# EAGLE design TOP_1P (EAGLE 9.6.2)
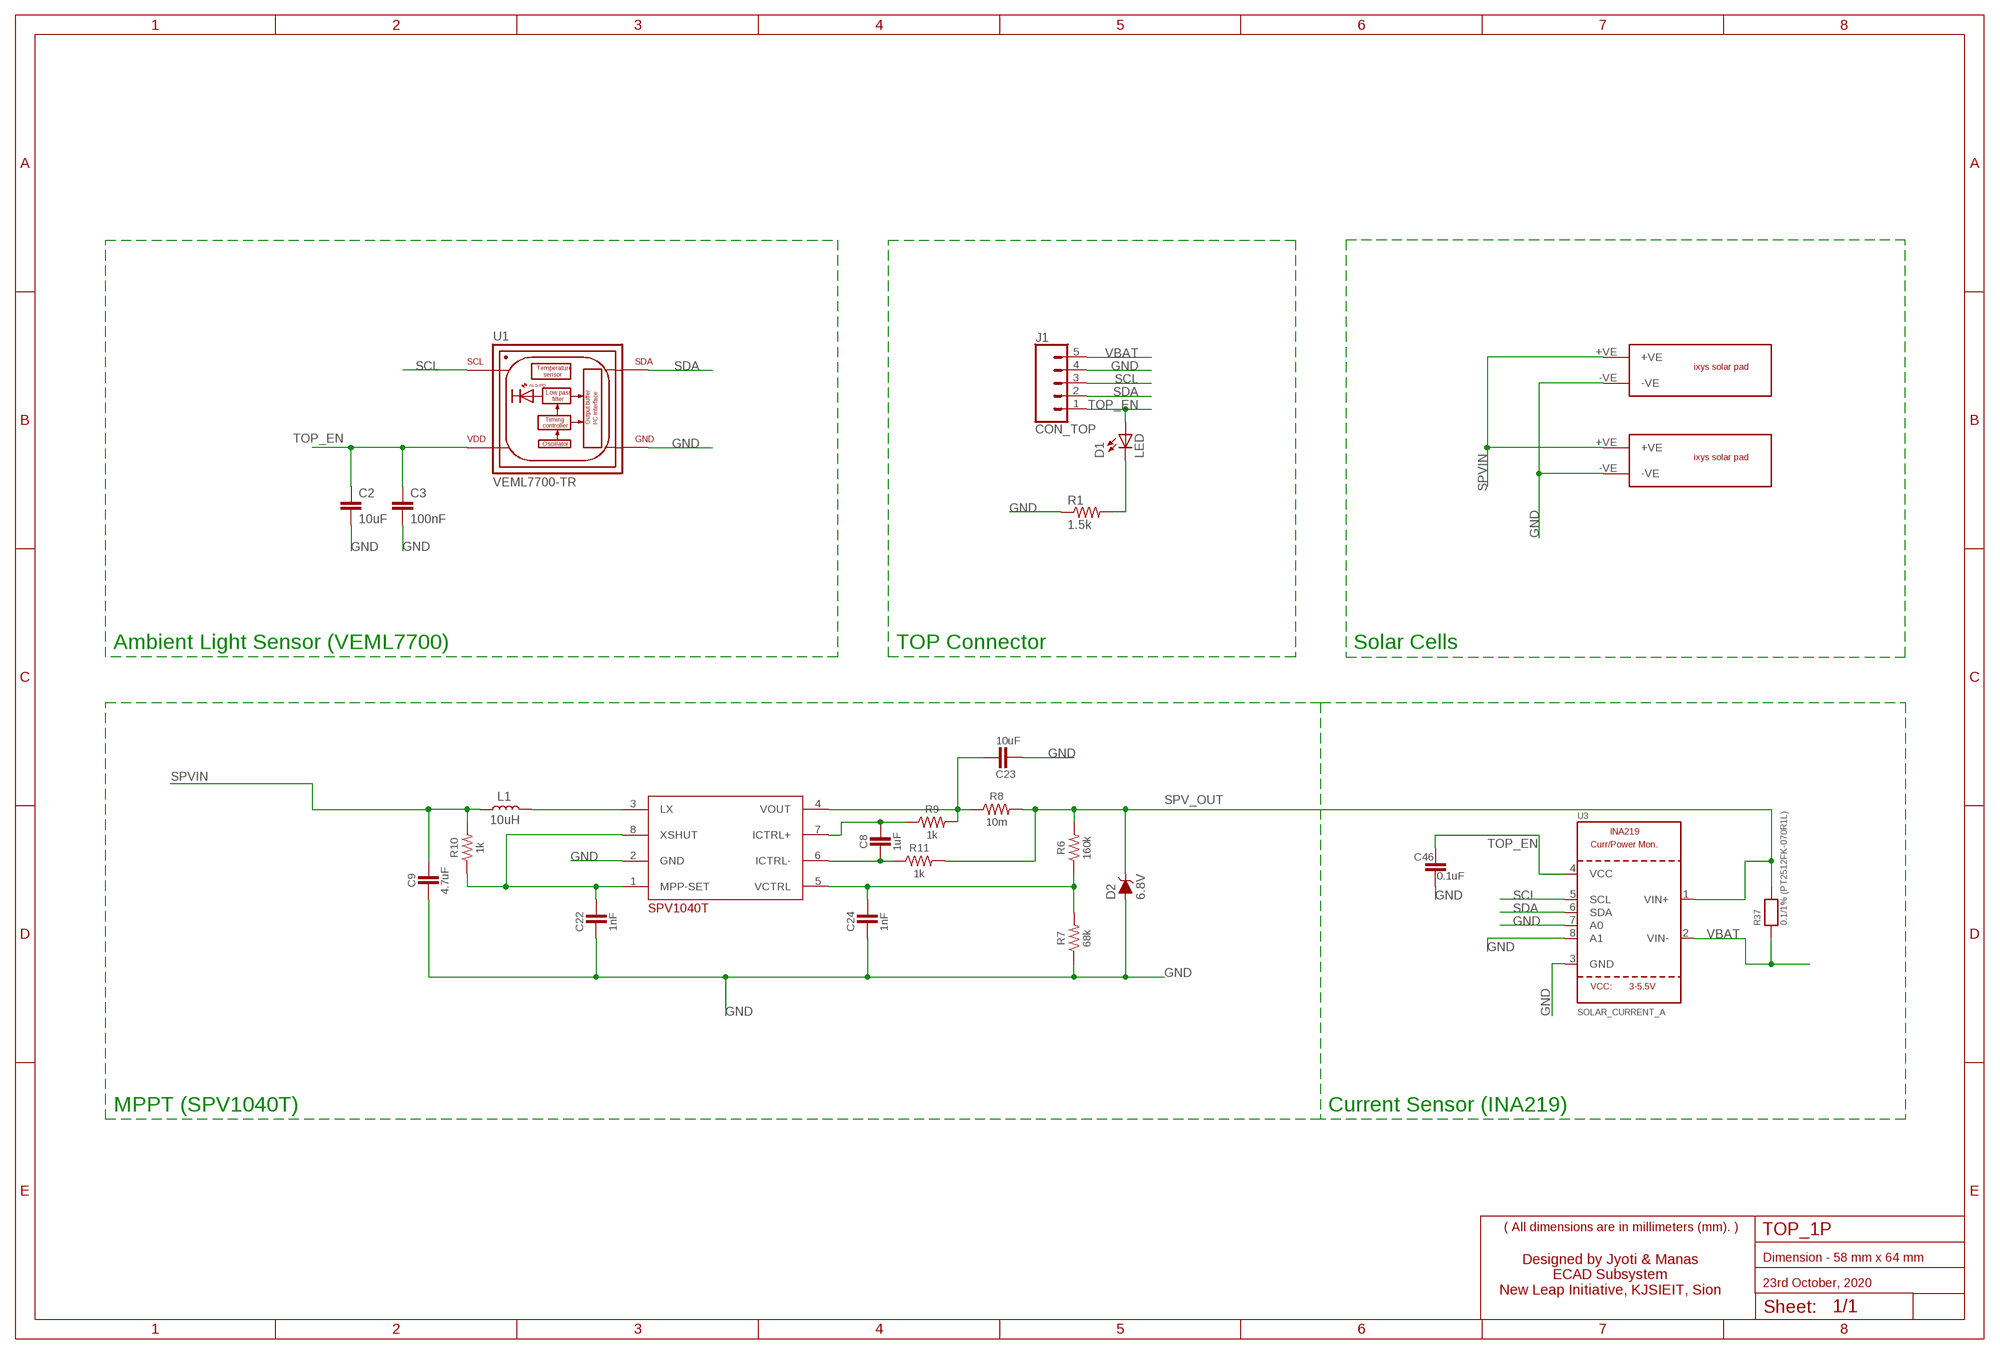
[diagram p0: schematic, sheet 1]

## Parts
C2  10uF  2.2NF/2200PF-0603-50V-10%  [0603]
C3  100nF  2.2NF/2200PF-0603-50V-10%  [0603]
C8  1uF  10UF-0603-6.3V-20%  [0603]
C9  4.7uF  10UF-0603-6.3V-20%  [0603]
C22  1nF  10UF-0603-6.3V-20%  [0603]
C23  10uF  10UF-0603-6.3V-20%  [0603]
C24  1nF  10UF-0603-6.3V-20%  [0603]
C46  0.1uF  10UF-0603-6.3V-20%  [0603]
D2  6.8V  DIODE-ZENER-MMSZ5232BS  [SOD-323]
J1  CON_TOP  CONN_051.27MM  [1X05_1.27MM]
L1  10uH  INDUCTOR-0603-33NH  [0603]
LED  D1  LEDCHIP-LED0603  [CHIP-LED0603]
R1  1.5k  R-US_R0603  [R0603]
R6  160k  RC0603JR-070RL  [RES_0603]
R7  68k  RC0603JR-070RL  [RES_0603]
R8  10m  RC0603JR-070RL  [RES_0603]
R9  1k  RC0603JR-070RL  [RES_0603]
R10  1k  RC0603JR-070RL  [RES_0603]
R11  1k  RC0603JR-070RL  [RES_0603]
R37  0.1/1% (PT2512FK-070R1L)  RESISTOR2512  [2512]
U1  VEML7700-TR  [XDCR_VEML7700-TR]
U2  U2  SPV1040T_  [SOP65P640X120-8N]
U3  SOLAR_CURRENT_A  INA219  [SOT23-8]
U$1  IXYS  [IXYS]
U$2  IXYS  [IXYS]

## Nets
GND [vcc]: C2.2 C3.2 C9.2 C22.2 C23.2 C24.2 C46.2 D2.A J1.4 R1.1 R7.1 U1.3(GND) U2.2(GND) U3.3(GND) U3.7(A0) U3.8(A1) U$1.-VE U$2.-VE
N$1: LED.C R1.2
N$5: L1.2 U2.3(LX)
N$31: C22.1 R10.1 U2.1(MPP-SET) U2.8(XSHUT)
N$32: C24.1 R6.1 R7.2 U2.5(VCTRL)
N$34: C8.2 R11.1 U2.6(ICTRL-)
N$35: C8.1 R9.1 U2.7(ICTRL+)
N$36: C23.1 R8.1 R9.2 U2.4(VOUT)
SCL: J1.3 U1.1(SCL) U3.5(SCL)
SDA: J1.2 U1.4(SDA) U3.6(SDA)
SPV_OUT: D2.C R6.2 R8.2 R11.2 R37.2 U3.1(VIN+)
SPVIN: C9.1 L1.1 R10.2 U$1.+VE U$2.+VE
TOP_EN: C2.1 C3.1 C46.1 J1.1 LED.A U1.2(VDD) U3.4(VCC)
VBAT: J1.5 R37.1 U3.2(VIN-)

## Notes on the sheet
- Ambient Light Sensor (VEML7700) | TOP Connector | Solar Cells
- MPPT (SPV1040T) | Current Sensor (INA219)
- ( All dimensions are in millimeters (mm). )
- Dimension - 58 mm x 64 mm
- Designed by Jyoti & Manas
  ECAD Subsystem
  New Leap Initiative, KJSIEIT, Sion
- 23rd October, 2020

## Library data of the parts
C2 C3 = SparkFun-Capacitors:2.2NF/2200PF: 2.2nF/2,200pF ceramic capacitors A capacitor is a passive two-terminal electrical component used to store electrical energy temporarily in an electric field.; PROD_ID: CAP-07877; VALUE: 2.2nF
C8 C9 C22 C24 C46 = SparkFun-Capacitors:10UF: 10.0µF ceramic capacitors A capacitor is a passive two-terminal electrical component used to store electrical energy temporarily in an electric field.; PROD_ID: CAP-11015; VALUE: 10uF
C23 = SparkFun-Capacitors:10UF: 10.0µF ceramic capacitors A capacitor is a passive two-terminal electrical component used to store electrical energy temporarily in an electric field.; PROD_ID: CAP-11015
D2 = SparkFun-DiscreteSemi:DIODE-ZENER: Zener Diode A Zener diode allows current to flow from its anode to its cathode like a normal semiconductor diode, but it also permits current to flow in the reverse direction when its "Zener voltage" is reached. - WIkipedia; PROD_ID: DIO-12442; VALUE: 5.6V
J1 = SparkFun-Connectors:CONN_05: Multi connection point. Often used as Generic Header-pin footprint for 0.1 inch spaced/style header connections On any of the 0.1 inch spaced packages, you can populate with these: Break Away Headers - Straight <https://www.sparkfun.com/products/116> (PRT-00116) Break Away Male Headers - Right Angle <https://www.sparkfun.com/products/553> (PRT-00553) Female Headers <https://www.sparkfun.com/products/115> (PRT-00115) Break Away Headers - Machine Pin <https://www.sparkfun.com/products/117> (PRT-00117) Break Away Female Headers - Swiss Machine Pin <https://www.sparkfun.com/products/743> (PRT-00743) For SCREWTERMINALS and SPRING TERMINALS visit here: Screw Terimnals on SparkFun.com <https://www.sparkfun.com/search/results?term=Screw+Terminals> (5mm/3.5mm/2.54mm spacing) This device is also useful as a general connection point to wire up your design to another part of your project. Our various solder wires solder well into these plated through hole pads. Hook-Up Wire - Assortment (Stranded, 22 AWG) <https://www.sparkfun.com/products/11375> (PRT-11375) Hook-Up Wire - Assortment (Solid Core, 22 AWG) <https://www.sparkfun.com/products/11367> (PRT-11367) View the entire wire category on our website here <https://www.sparkfun.com/categories/141> Special notes: Molex polarized connector foot print use with SKU : PRT-08231 with associated crimp pins and housings. 1MM SMD Version SKU: PRT-10208
L1 = SparkFun-Coils:INDUCTOR: Inductors Resist changes in electrical current. Basically a coil of wire. SparkFun Products: SparkFun Load Cell Amplifier - HX711 <https://www.sparkfun.com/products/13879> IOIO-OTG - V2.2 <https://www.sparkfun.com/products/13613>; PROD_ID: NDUC-07874; VALUE: 33nH/±5%/500mA
LED = adafruit:LED: LED OSRAM: - CHIPLED LG R971, LG N971, LY N971, LG Q971, LY Q971, LO R971, LY R971 LH N974, LH R974 LS Q976, LO Q976, LY Q976 LO Q996 - Hyper CHIPLED LW Q18S LB Q993, LB Q99A, LB R99A - SideLED LS A670, LO A670, LY A670, LG A670, LP A670 LB A673, LV A673, LT A673, LW A673 LH A674 LY A675 LS A676, LA A676, LO A676, LY A676, LW A676 LS A679, LY A679, LG A679 - Hyper Micro SIDELED® LS Y876, LA Y876, LO Y876, LY Y876 LT Y87S - SmartLED LW L88C, LW L88S LB L89C, LB L89S, LG L890 LS L89K, LO L89K, LY L89K LS L896, LA L896, LO L896, LY L896 - TOPLED LS T670, LO T670, LY T670, LG T670, LP T670 LSG T670, LSP T670, LSY T670, LOP T670, LYG T670 LG T671, LOG T671, LSG T671 LB T673, LV T673, LT T673, LW T673 LH T674 LS T676, LA T676, LO T676, LY T676, LB T676, LH T676, LSB T676, LW T676 LB T67C, LV T67C, LT T67C, LS T67K, LO T67K, LY T67K, LW E67C LS E67B, LA E67B, LO E67B, LY E67B, LB E67C, LV E67C, LT E67C LW T67C LS T679, LY T679, LG T679 LS T770, LO T770, LY T770, LG T770, LP T770 LB T773, LV T773, LT T773, LW T773 LH T774 LS E675, LA E675, LY E675, LS T675 LS T776, LA T776, LO T776, LY T776, LB T776 LHGB T686 LT T68C, LB T68C - Hyper Mini TOPLED® LB M676 - Mini TOPLED Santana® LG M470 LS M47K, LO M47K, LY M47K Source: http://www.osram.convergy.de/
R1 = adafruit:R-US_: RESISTOR, American symbol
R6-R11 = Resistor_Capacitor:RC0603JR-070RL: RES SMD 0 OHM JUMPER 1/10W 0603 Manufacturer's datasheet <http://www.yageo.com/documents/recent/PYu-RC_Group_51_RoHS_L_10.pdf>; CREATED_BY: PCBLayout.com; DIGIKEY_PART_NUMBER: 311-0.0GRTR-ND; MANUFACTURER: Yageo; MPN: RC0603JR-070RL; PACKAGE: SMD 0603
R37 = microbuilder:RESISTOR: Resistors 0402 - 0402 Surface Mount Package 22 Ohm 1% 1/16W [Digikey: 311-22.0LRTR-ND] 33 Ohm 5% 1/16W 1.0K 5% 1/16W 1.5K 5% 1/16W 2.0K 1% 1/16W 10.0K 1% 1/16W [Digikey: 311-10.0KLRTR-ND] 10.0K 5% 1/16W [Digikey: RMCF0402JT10K0TR-ND] 12.1K 1% 1/16W [Digikey: 311-22.0LRTR-ND] 100.0K 5% 1/16W 0603 - 0603 Surface Mount Package 0 Ohm 1/10 Watt 1% Resistor 15 Ohm 1/10 Watt 1% Resistor 33 Ohm 1/10 Watt 1% Resistor 49.9 Ohm 1/10 Watt 1% Resistor 100 Ohm 1/10 Watt 1% Resistor 150 Ohm 1/10 Watt 1% Resistor 240 Ohm 1/10 Watt 1% Resistor 390 Ohm 1/10 Watt 1% Resistor 560 Ohm 1/10 Watt 1% Resistor 680 Ohm 1/10 Watt 1% Resistor 750 Ohm 1/10 Watt 1% Resistor 1.0K Ohm 1/10 Watt 1% Resistor 1.5K Ohm 1/10 Watt 1% Resistor 2.0K Ohm 1/10 Watt 1% Resistor 2.2K Ohm 1/10 Watt 1% Resistor 3.3K Ohm 1/10 Watt 1% Resistor 4.7K Ohm 1/10 Watt 1% Resistor 10.0K Ohm 1/10 Watt 1% Resistor 12.0K Ohm 1/10 Watt 1% Resistor 12.1K Ohm 1/10 Watt 1% Resistor 20.0K Ohm 1/10 Watt 1% Resistor 33.0K Ohm 1/10 Watt 1% Resistor 100.0K Ohm 1/10 Watt 1% Resistor 0805 - 0805 Surface Mount Package 0 Ohm 1/8 Watt 1% Resistor 33 Ohm 1/8 Watt 1% Resistor 100 Ohm 1/8 Watt 1% Resistor 150 Ohm 1/8 Watt 1% Resistor 200 Ohm 1/8 Watt 1% Resistor 240 Ohm 1/8 Watt 1% Resistor 330 Ohm 1/8 Watt 1% Resistor 390 Ohm 1/8 Watt 1% Resistor 470 Ohm 1/8 Watt 1% Resistor 1.0K Ohm 1/8 Watt 1% Resistor 1.5K Ohm 1/8 Watt 1% Resistor 2.0K Ohm 1/8 Watt 1% Resistor 4.7K Ohm 1/8 Watt 1% Resistor 5.1K Ohm 1/8 Watt 1% Resistor 5.6K Ohm 1/8 Watt 1% Resistor 10.0K Ohm 1/8 Watt 1% Resistor 22.0K Ohm 1/8 Watt 1% Resistor 33.0K Ohm 1/8 Watt 1% Resistor 100K Ohm 1/8 Watt 1% Resistor 1206 - 1206 Surface Mount Package 2012 - 2010 Surface Mount Package 0.11 Ohm 1/2 Watt 1% Resistor - Digikey: RHM.11UCT-ND
U1 = VEML7700-TR:VEML7700-TR: Light to Digital Ambient Light Sensor Digital 0lux to 167000lux 8-Pin SMD T/R; ARROW_ELECTRONICS-PURCHASE-URL: https://snapeda.com/shop?store=Arrow+Electronics&id=620383; DESCRIPTION: Optical Sensor Ambient 545nm I²C 4-SMD, J-Lead; DIGI-KEY_PART_NUMBER: VEML7700CT-ND; DIGIKEY-PURCHASE-URL: https://snapeda.com/shop?store=DigiKey&id=620383; MF: Vishay; MOUSER-PURCHASE-URL: https://snapeda.com/shop?store=Mouser&id=620383; MP: VEML7700-TR; PACKAGE: SMD-4 Vishay
U2 = SPV1040T:SPV1040T_
U3 = microbuilder:INA219: INA219 - I2C Current/Power Monitor Voltage Range: 0-26V Accuracy: 0.5% Temperature: -40°C - 125°C
U$1 U$2 = ixys:IXYS

## Net classes
1 vcc: width 0.254 mm

## Board
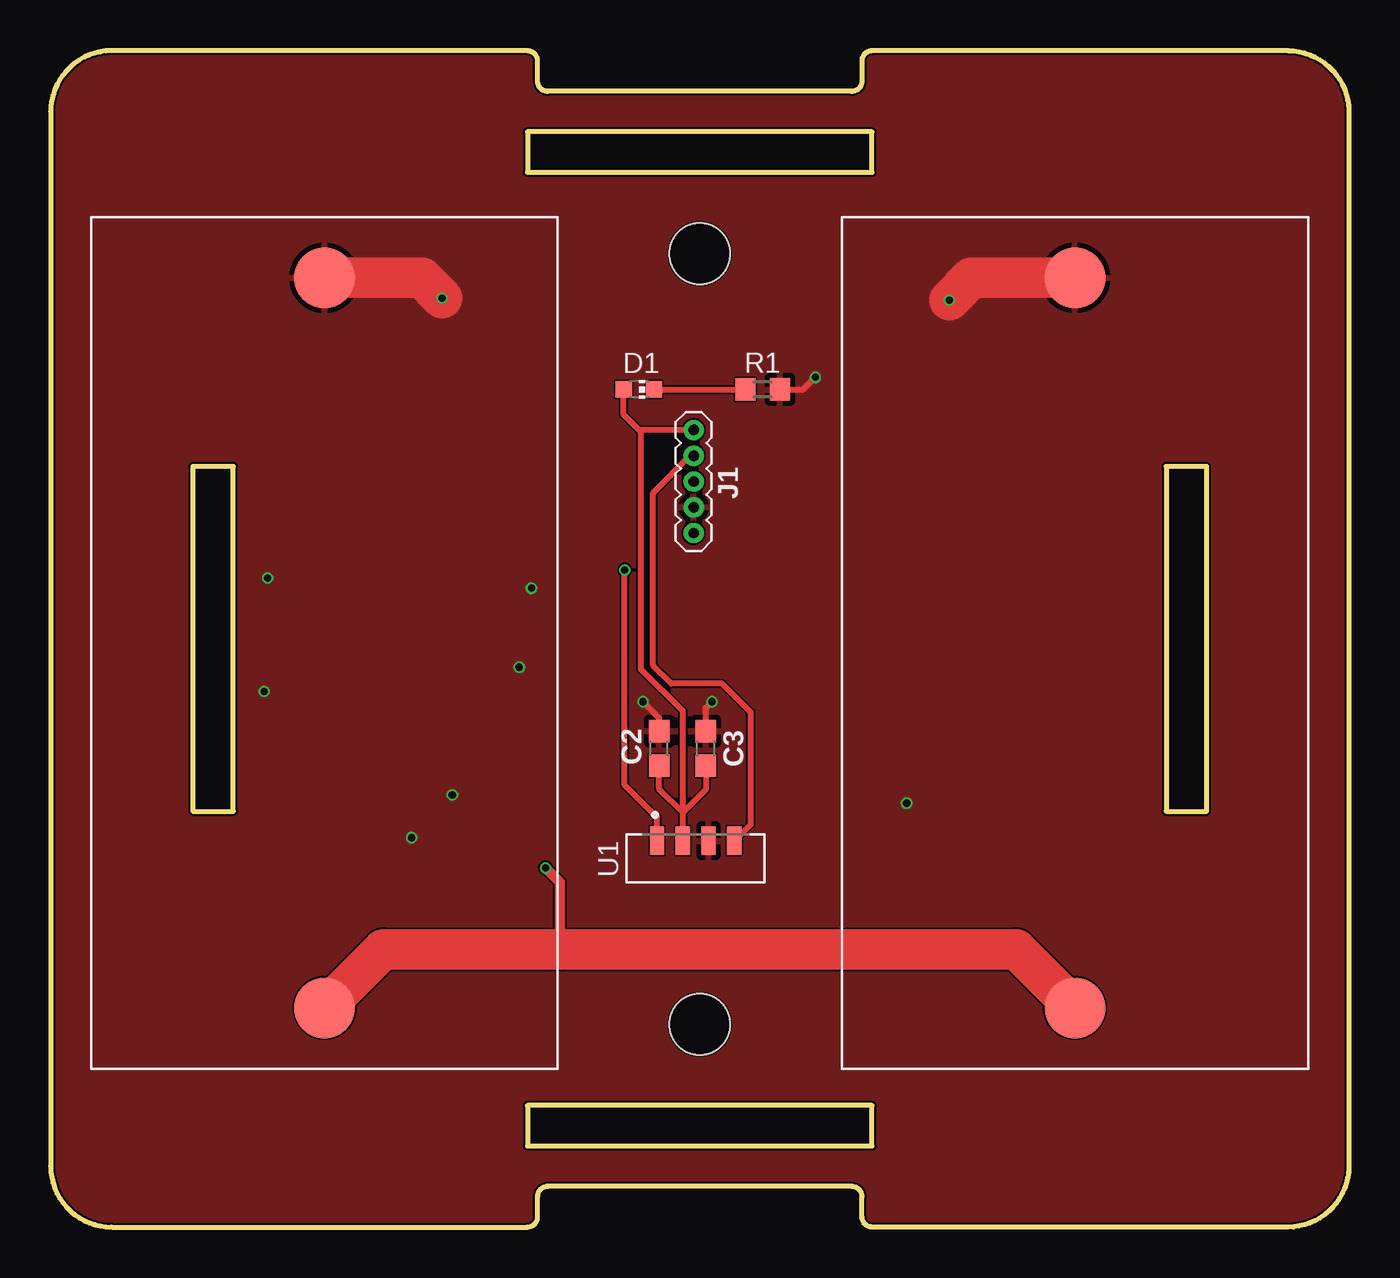
[diagram p1: board, top side]
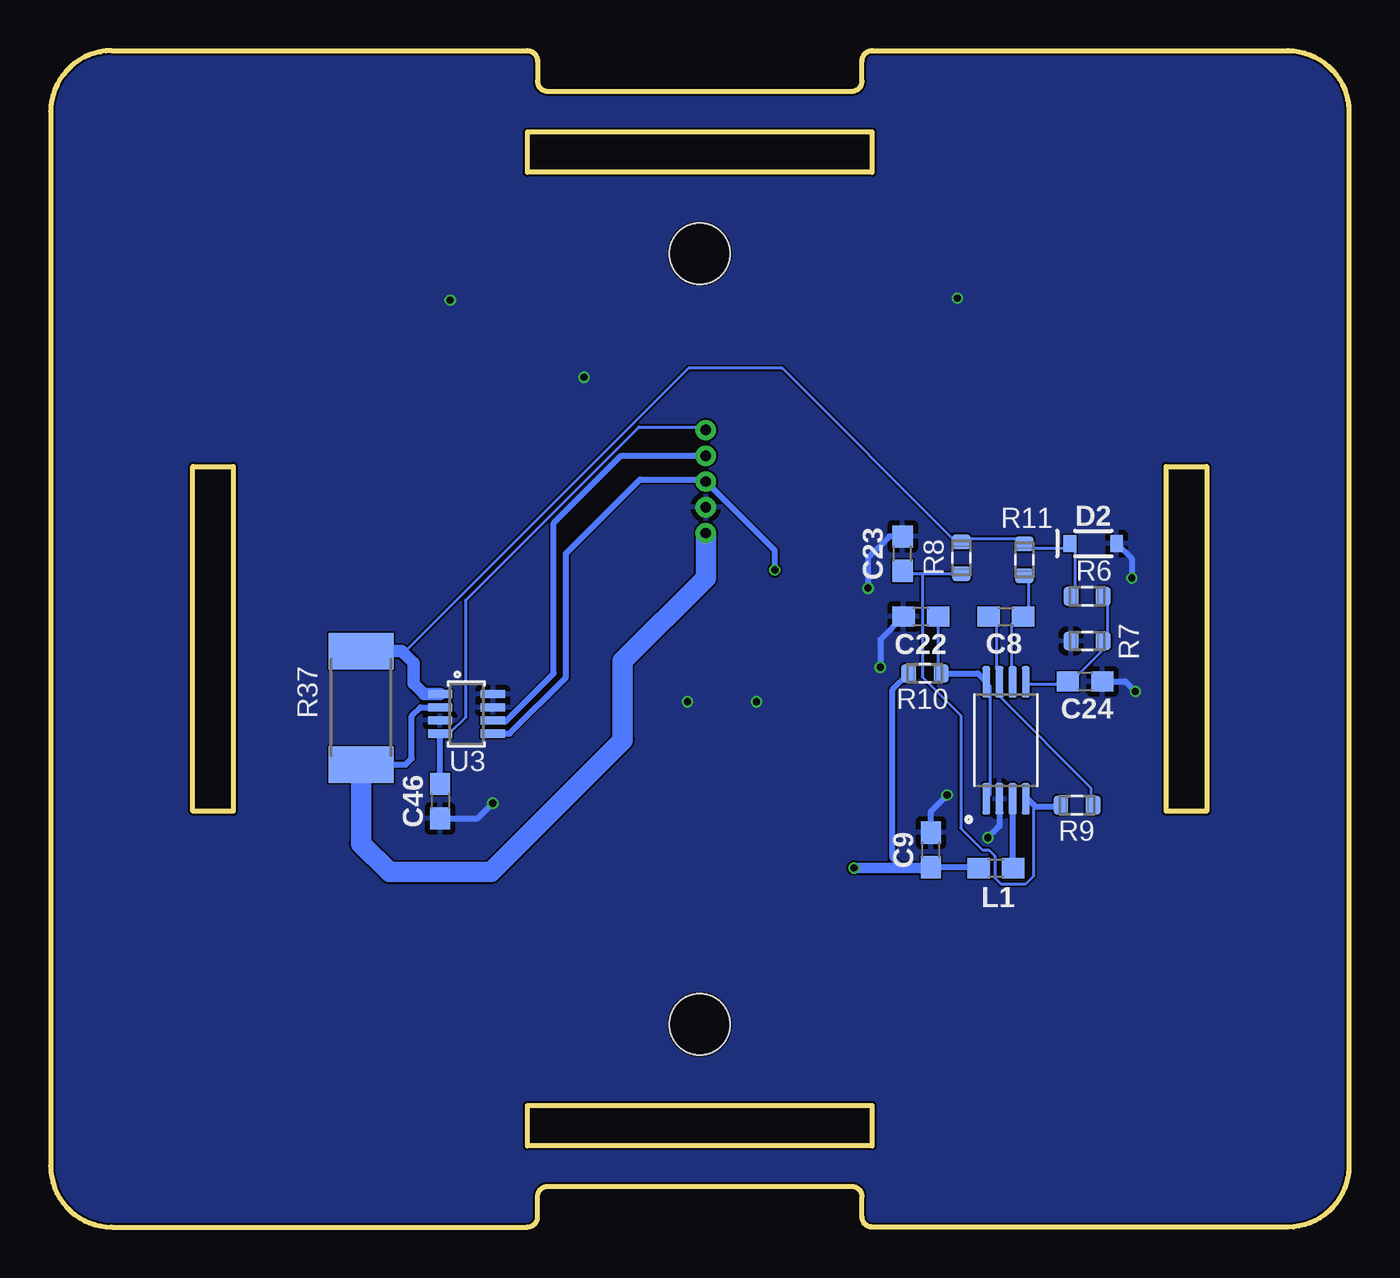
[diagram p2: board, bottom side, seen from below]

Size 64 x 58 mm. Coordinates in mm from the lower left corner, seen from the top.
Outline: 61,0 40.5,0 arc-90 40,0.5 40,1.5 arc90 39.5,2 24.5,2 arc90 24,1.5 24,0.5 arc-90 23.5,0 3,0 arc-90 0,3 0,55 arc-90 3,58 23.5,58 arc-90 24,57.5 24,56.5 arc90 24.5,56 39.5,56 arc90 40,56.5 40,57.5 arc-90 40.5,58 61,58 arc-90 64,55 64,3 arc-90 61,0
Outline: 23.5,54 23.5,52 40.5,52 40.5,54 23.5,54
Outline: 23.5,6 23.5,4 40.5,4 40.5,6 23.5,6
Outline: 57,37.5 55,37.5 55,20.5 57,20.5 57,37.5
Outline: 9,37.5 7,37.5 7,20.5 9,20.5 9,37.5
Copper layers (1*16): Top 0.035mm / dielectric 0.2mm / Bottom 0.035mm
Design rules "jlcpcb-2-layer": minimum track width 3.5mil, minimum drill 0.2mm, track to track 3.5mil, track to pad 5mil, pad to pad 5mil, via to via 5mil, smd to smd 0mil, copper to edge 0.1mm, drill to drill 5mil, minimum pad ring 4mil, minimum via ring 4mil, stop-mask expansion 3mil, vias tented up to drill 100mil, thermal gap 10mil
Holes 3 mm at 32,48 32,10

### Footprints (pad centres in the part's own frame; a part is rotated, then mirrored left to right if it is on the bottom)
0603 = smd 1.1 x 1: 1 -0.85,0; 2 0.85,0
SOD-323 = smd 0.63 x 0.83: A 1.15,0; C -1.15,0
1X05_1.27MM = drill 0.508 pad 1: 1 0,0; 2 1.27,0; 3 2.54,0; 4 3.81,0; 5 5.08,0
CHIP-LED0603 = smd 0.8 x 0.8: A 0,-0.75; C 0,0.75
R0603 = smd 1 x 1.1: 1 -0.85,0; 2 0.85,0
RES_0603 = smd 0.74 x 0.93: 1 -0.795,0; 2 0.795,0
2512 = smd 1.8 x 3.2: 1 -2.8,0; 2 2.8,0
XDCR_VEML7700-TR = smd 1.4 x 0.7: 1 0.55,1.905; 2 0.55,0.635; 3 0.55,-0.635; 4 0.55,-1.905
SOP65P640X120-8N = smd 1.56 x 0.41: 1 -2.88,0.975; 2 -2.88,0.325; 3 -2.88,-0.325; 4 -2.88,-0.975; 5 2.88,-0.975; 6 2.88,-0.325; 7 2.88,0.325; 8 2.88,0.975
SOT23-8 = smd 0.4 x 1.2: 1 -0.975,-1.3; 2 -0.325,-1.3; 3 0.325,-1.3; 4 0.975,-1.3; 5 0.975,1.3; 6 0.325,1.3; 7 -0.325,1.3; 8 -0.975,1.3
IXYS = smd 3 x 3: +VE 3,11.5; -VE 39,11.5

### Placement (x,y rotation side)
C2  30,23.6 90 top
C3  32.3,23.6 90 top
C8  16.9,30.1 0 bottom
C9  20.6,18.6 90 bottom
C22  21.1,30.1 180 bottom
C23  22,33.2 90 bottom
C24  13,26.9 0 bottom
C46  44.8,21 270 bottom
D2  12.6,33.7 0 bottom
J1  31.7,39.3 270 top
L1  17.4,17.7 0 bottom
LED  29,41.3 270 top
R1  35.1,41.3 180 top
R6  12.9,31.1 180 bottom
R7  12.9,28.9 0 bottom
R8  19.1,33 90 bottom
R9  13.4,20.8 180 bottom
R10  20.9,27.3 180 bottom
R11  16,32.9 90 bottom
R37  48.7,25.6 90 bottom
U1  31.8,18.5 90 top
U2  16.9,24 90 bottom
U3  43.5,25.3 270 bottom
U$1  25,7.8 90 top
U$2  62,7.8 90 top

### Tracks (layer width: path | path; a pad name or v marks a point on that pad's centre or on a via)
GND  (via drill 0.35)
  Top 0.3: R1.1 37.1,41.3 v37.7,41.9 | C2.2 30,25.1 v29.2,25.9 | C3.2 32.3,25.6 v32.6,25.9
  Top 2: U$1.-VE 18.3,46.8 v19.3,45.8 | U$2.-VE 45.4,46.8 v44.3,45.7
  Bottom 0.3: C46.2 42.95,20.15 v42.2,20.9 | C24.2 11.02,26.9 v10.52,26.4 | C9.2 20.6,20.5 v19.8,21.3 | U2.2 17.23,19.77 v17.8,19.2 | C22.2 23.1,28.95 v23.1,27.6 | C23.2 22.65,34.05 23.7,33 v23.7,31.5 | D2.A 10.7,32.95 v10.7,32
  pour Bottom: -6.6,-1.2 -6.6,64 arc-90 -6.1,64.5 71.5,64.5 71.5,-1.5 arc-90 71,-2 -6.6,-2
  pour Top: -6.6,-2 -6.6,64.5 71.5,64.5 71.5,-2
N$1
  Top 0.3: LED.C R1.2
N$5
  Bottom 0.3: L1.2 16.55,21.09 U2.3
N$31
  Bottom 0.152: C22.1 20.25,27.45 R10.1 | U2.8 17.71,26.71 17.71,21.29 U2.1
  Bottom 0.3: R10.1 18.3,27.3 U2.8
N$32
  Bottom 0.152: R6.1 11.92,30.91 11.92,29.09 R7.2 12.02,28.81 12.02,28.55 13.67,26.9 C24.1 13.97,26.78 15.82,26.78 U2.5
N$34
  Bottom 0.152: R11.1 15.8,31.91 15.8,30.35 C8.2 16.25,30.1 16.64,29.71 | 16.64,29.71 16.64,26.94 U2.6 | 16.64,29.71
N$35
  Bottom 0.152: R9.1 12.71,20.9 12.71,21.65 17.23,26.17 17.23,26.18 U2.7 17.23,27.48 17.38,27.63 17.38,29.83 17.65,30.1 C8.1
N$36
  Bottom 0.152: R8.1 21.03,32.2 | C23.1 21.88,32.23 21.06,32.23 21.03,32.2 | 15.54,20.84 15.54,17.3 15.93,16.92 17.14,16.92 17.45,17.22 17.45,18.29 17.75,18.59 18.06,18.59 19.13,19.66 19.13,25.22 21.03,27.13 21.03,32.2
  Bottom 0.3: U2.4 15.82,21.12 15.54,20.84 15.43,20.72 14.28,20.72 R9.2
SCL  (via drill 0.35)
  Top 0.3: U1.1 29.89,20.2 28.3,21.8 v28.3,32.4
  Bottom 0.3: U3.5 41.38,24.32 38.6,27.1 38.6,33.2 34.94,36.86 31.8,36.86 J1.3 28.3,33.36 v28.3,32.4
SDA
  Top 0.3: U1.4 34.51,19.85 34.51,25.39 33.1,26.8 30.6,26.8 29.7,27.7 29.7,36.2 31.53,38.03 J1.2
  Bottom 0.3: U3.6 42.15,24.92 41.58,24.92 39.2,27.3 39.2,34.7 35.87,38.03 J1.2
SPV_OUT
  Bottom 0.152: R6.2 13.52,31.28 13.52,33.47 D2.C 13.97,33.48 15.79,33.48 R11.2 16.26,33.96 18.94,33.96 R8.2 19.39,33.8 27.93,42.34 32.57,42.34 46.6,28.3
  Bottom 0.61: R37.2 46.7,28.4 46.6,28.3 46.1,27.8 46.1,26.8 45.58,26.28 U3.1
SPVIN  (via drill 0.35)
  Top 0.508: 25.1,13.7 25.1,17 v24.4,17.7
  Top 2: U$1.+VE 16.4,13.7 25.1,13.7 47.6,13.7 U$2.+VE
  Bottom 0.3: C9.1 18.3,17.75 L1.1 | 22,17.7 22.5,18.2 22.5,26.5 R10.2
  Bottom 0.508: v24.4,17.7 22,17.7 20.65,17.7 C9.1
TOP_EN
  Top 0.3: U1.2 31.16,20.43 | 31.16,20.43 30,21.6 C2.1 | C3.1 32.3,21.57 31.16,20.43 | J1.1 29.1,39.3 | 29.1,39.3 29,39.3 28.25,40.05 LED.A | 31.16,20.43 31.16,25.43 29.1,27.5 29.1,39.3
  Bottom 0.152: J1.1 31.84,39.44 35,39.44 43.55,30.89 43.55,25.13 44.35,24.32 U3.4
  Bottom 0.3: C46.1 U3.4
VBAT
  Bottom 0.3: R37.1 46.5,22.8 46.2,23.1 46.2,25.2 45.77,25.62 U3.2
  Bottom 1: R37.1 48.7,18.9 47.3,17.5 42.3,17.5 35.8,24 35.8,27.9 31.7,32 J1.5

### Text on the board
tNames: D1